# EAGLE schematic FULLMONI-WIDE_MAIN-Board_SCH (EAGLE 9.7.0)

## Sheet 1 of 4
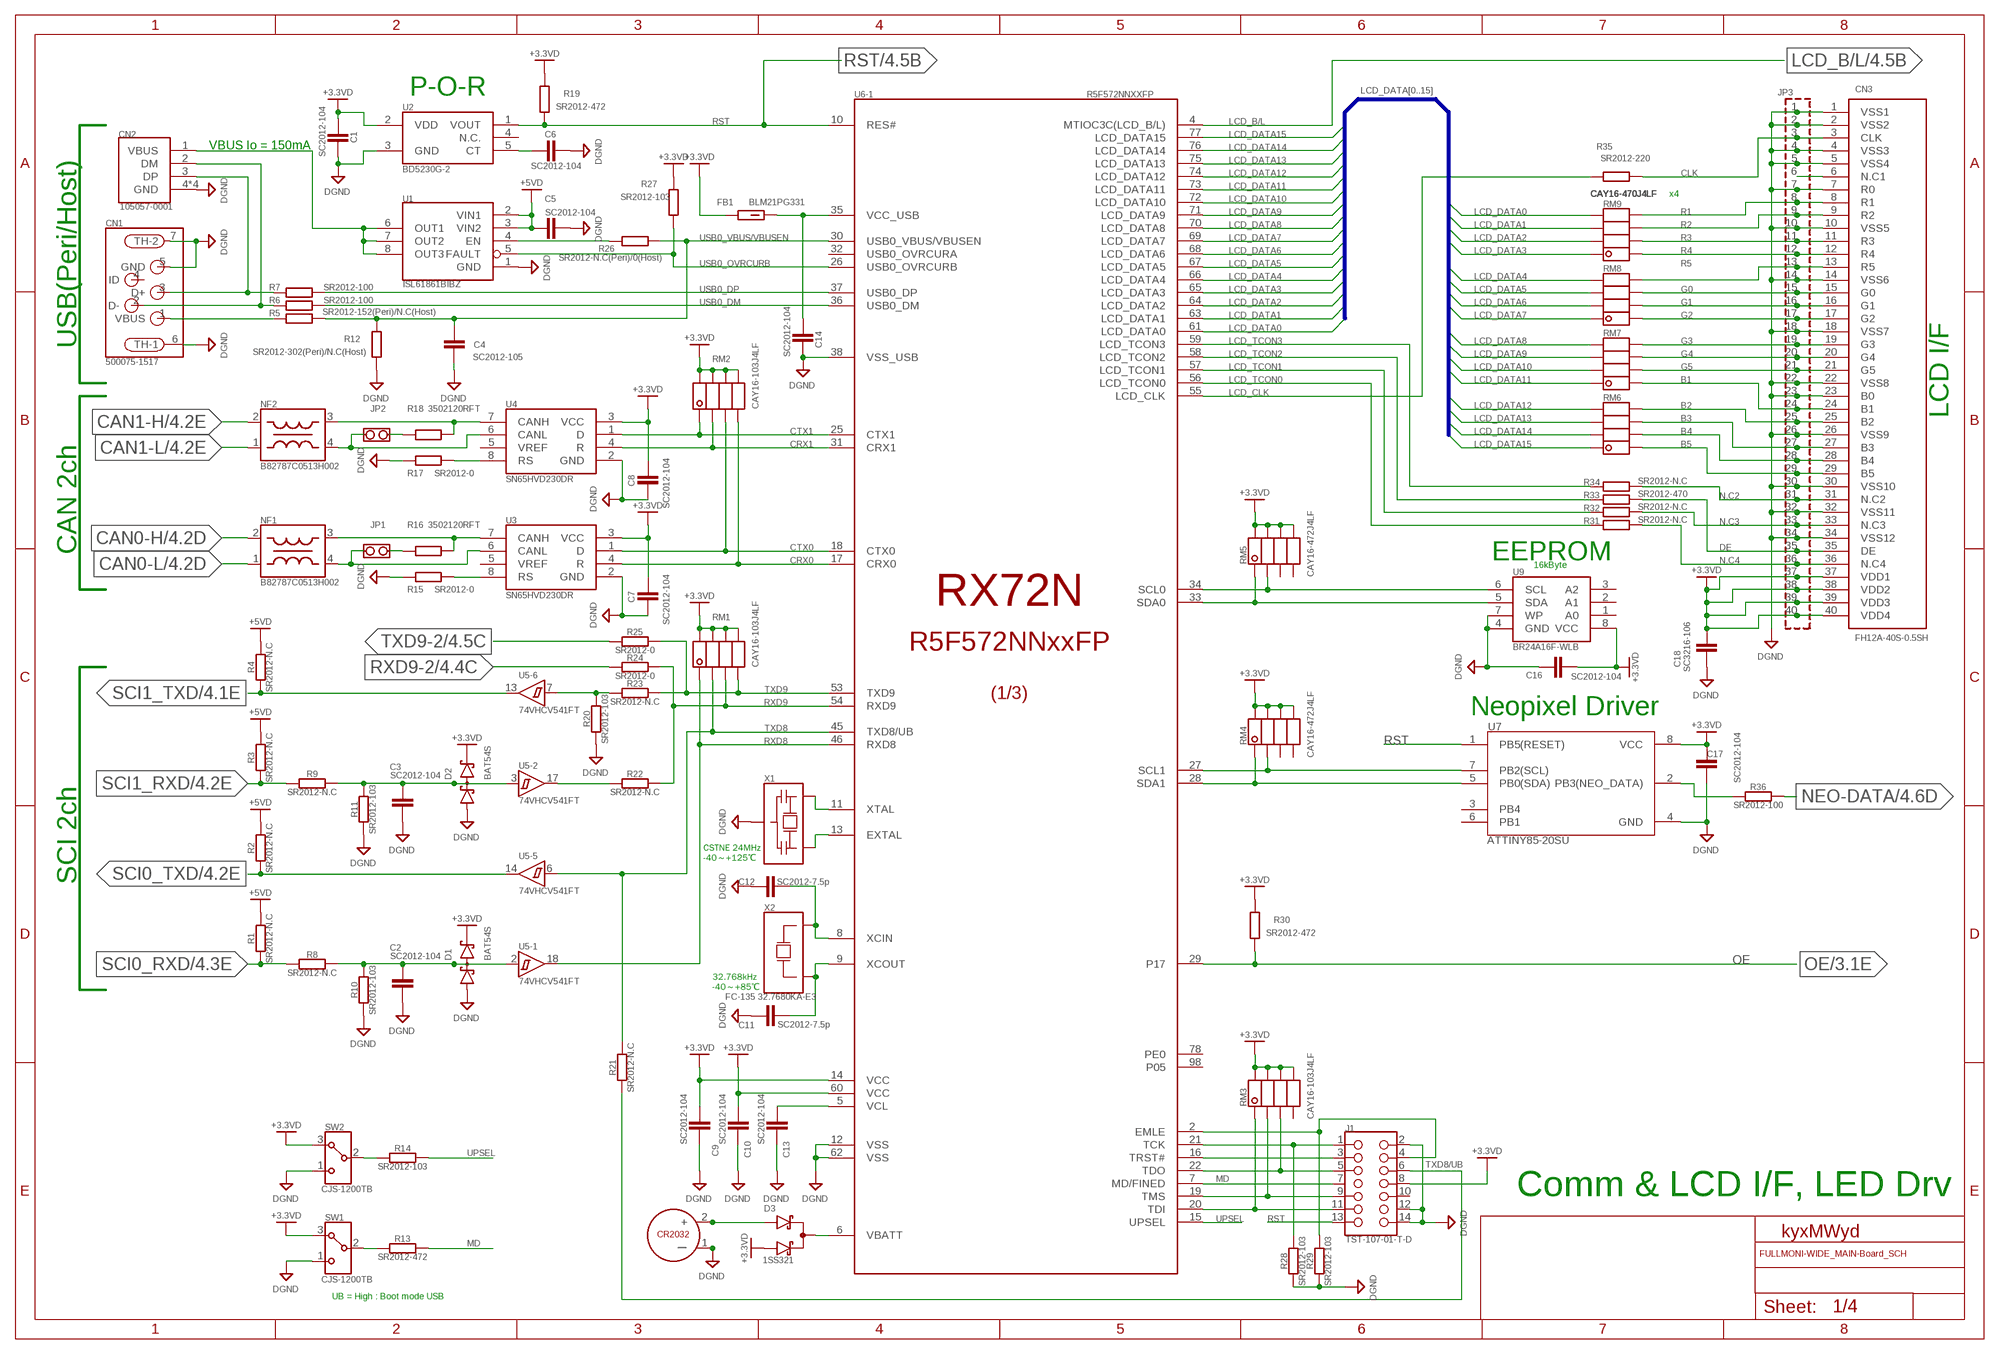
[diagram p0: schematic, sheet 1]

### Parts
BT1  120591-1  [120591-1]
C1  SC2012-104  C_CHIP-0805(2012-METRIC)  [CAPC2012X110]
C2  SC2012-104  C_CHIP-0805(2012-METRIC)  [CAPC2012X110]
C3  SC2012-104  C_CHIP-0805(2012-METRIC)  [CAPC2012X110]
C4  SC2012-105  C_CHIP-0805(2012-METRIC)  [CAPC2012X110]
C5  SC2012-104  C_CHIP-0805(2012-METRIC)  [CAPC2012X110]
C6  SC2012-104  C_CHIP-0805(2012-METRIC)  [CAPC2012X110]
C7  SC2012-104  C_CHIP-0805(2012-METRIC)  [CAPC2012X110]
C8  SC2012-104  C_CHIP-0805(2012-METRIC)  [CAPC2012X110]
C9  SC2012-104  C_CHIP-0805(2012-METRIC)  [CAPC2012X110]
C10  SC2012-104  C_CHIP-0805(2012-METRIC)  [CAPC2012X110]
C11  SC2012-7.5p  C_CHIP-0805(2012-METRIC)  [CAPC2012X110]
C12  SC2012-7.5p  C_CHIP-0805(2012-METRIC)  [CAPC2012X110]
C13  SC2012-104  C_CHIP-0805(2012-METRIC)  [CAPC2012X110]
C14  SC2012-104  C_CHIP-0805(2012-METRIC)  [CAPC2012X110]
C16  SC2012-104  C_CHIP-0805(2012-METRIC)  [CAPC2012X110]
C17  SC2012-104  C_CHIP-0805(2012-METRIC)  [CAPC2012X110]
C18  SC3216-106  C_CHIP-1206(3216-METRIC)  [CAPC3216X135]
CN1  500075-1517  [500075-1517]
CN2  105057-0001  [105057-0001]
CN3  FH12A-40S-0.5SH  [FH12A-40S-0.5SH]
D1  BAT54S  [SOT23]
D2  BAT54S  [SOT23]
D3  1SS321  [1SS321]
FB1  BLM21PG331  FB_BLM21PG331SN1D_0805(2012)  [BEADC2012X105N]
J1  TST-107-01-T-D  SAMTEC-TST-107-01-X-DJ  [SAMTEC-TST-107-01-X-D]
JP1  PINHD-1X2/90  [1X02/90]
JP2  PINHD-1X2/90  [1X02/90]
JP3  PINHD-2X20  [2X20]
NF1  B82787C0513H002  ACT45B-510-2P  [ACT45B-510-2P]
NF2  B82787C0513H002  ACT45B-510-2P  [ACT45B-510-2P]
R1  SR2012-N.C  R_CHIP-0805(2012-METRIC)  [RESC2012X65]
R2  SR2012-N.C  R_CHIP-0805(2012-METRIC)  [RESC2012X65]
R3  SR2012-N.C  R_CHIP-0805(2012-METRIC)  [RESC2012X65]
R4  SR2012-N.C  R_CHIP-0805(2012-METRIC)  [RESC2012X65]
R5  SR2012-152(Peri)/N.C(Host)  R_CHIP-0805(2012-METRIC)  [RESC2012X65]
R6  SR2012-100  R_CHIP-0805(2012-METRIC)  [RESC2012X65]
R7  SR2012-100  R_CHIP-0805(2012-METRIC)  [RESC2012X65]
R8  SR2012-N.C  R_CHIP-0805(2012-METRIC)  [RESC2012X65]
R9  SR2012-N.C  R_CHIP-0805(2012-METRIC)  [RESC2012X65]
R10  SR2012-103  R_CHIP-0805(2012-METRIC)  [RESC2012X65]
R11  SR2012-103  R_CHIP-0805(2012-METRIC)  [RESC2012X65]
R12  SR2012-302(Peri)/N.C(Host)  R_CHIP-0805(2012-METRIC)  [RESC2012X65]
R13  SR2012-472  R_CHIP-0805(2012-METRIC)  [RESC2012X65]
R14  SR2012-103  R_CHIP-0805(2012-METRIC)  [RESC2012X65]
R15  SR2012-0  R_CHIP-0805(2012-METRIC)  [RESC2012X65]
R16  3502120RFT  R_CHIP-2010(5025-METRIC)  [RESC5025X71]
R17  SR2012-0  R_CHIP-0805(2012-METRIC)  [RESC2012X65]
R18  3502120RFT  R_CHIP-2010(5025-METRIC)  [RESC5025X71]
R19  SR2012-472  R_CHIP-0805(2012-METRIC)  [RESC2012X65]
R20  SR2012-103  R_CHIP-0805(2012-METRIC)  [RESC2012X65]
R21  SR2012-N.C  R_CHIP-0805(2012-METRIC)  [RESC2012X65]
R22  SR2012-N.C  R_CHIP-0805(2012-METRIC)  [RESC2012X65]
R23  SR2012-N.C  R_CHIP-0805(2012-METRIC)  [RESC2012X65]
R24  SR2012-0  R_CHIP-0805(2012-METRIC)  [RESC2012X65]
R25  SR2012-0  R_CHIP-0805(2012-METRIC)  [RESC2012X65]
R26  SR2012-N.C(Peri)/0(Host)  R_CHIP-0805(2012-METRIC)  [RESC2012X65]
R27  SR2012-103  R_CHIP-0805(2012-METRIC)  [RESC2012X65]
R28  SR2012-103  R_CHIP-0805(2012-METRIC)  [RESC2012X65]
R29  SR2012-103  R_CHIP-0805(2012-METRIC)  [RESC2012X65]
R30  SR2012-472  R_CHIP-0805(2012-METRIC)  [RESC2012X65]
R31  SR2012-N.C  R_CHIP-0805(2012-METRIC)  [RESC2012X65]
R32  SR2012-N.C  R_CHIP-0805(2012-METRIC)  [RESC2012X65]
R33  SR2012-470  R_CHIP-0805(2012-METRIC)  [RESC2012X65]
R34  SR2012-N.C  R_CHIP-0805(2012-METRIC)  [RESC2012X65]
R35  SR2012-220  R_CHIP-0805(2012-METRIC)  [RESC2012X65]
R36  SR2012-100  R_CHIP-0805(2012-METRIC)  [RESC2012X65]
RM1  CAY16-103J4LF  CN1J4TTD000J  [CN1J4TTD000J]
RM2  CAY16-103J4LF  CN1J4TTD000J  [CN1J4TTD000J]
RM3  CAY16-103J4LF  CN1J4TTD000J  [CN1J4TTD000J]
RM4  CAY16-472J4LF  CN1J4TTD000J  [CN1J4TTD000J]
RM5  CAY16-472J4LF  CN1J4TTD000J  [CN1J4TTD000J]
RM6  CAY16-470J4LF  CN1J4TTD000J  [CN1J4TTD000J]
RM7  CAY16-470J4LF  CN1J4TTD000J  [CN1J4TTD000J]
RM8  CAY16-470J4LF  CN1J4TTD000J  [CN1J4TTD000J]
RM9  CAY16-470J4LF  CN1J4TTD000J  [CN1J4TTD000J]
SW1  CJS-1200TB  CJS-1200B  [CJS-1200B]
SW2  CJS-1200TB  CJS-1200B  [CJS-1200B]
U1  ISL61861BIBZ  [ISL61861BIBZ]
U2  BD5230G-2  BD5230G-1  [BD5230G-1]
U3  SN65HVD230DR  SN65HVD230D  [SO-8]
U4  SN65HVD230DR  SN65HVD230D  [SO-8]
U5  74VHCV541FT  [74VHCV54XFT]
U6  R5F572NNXXFP  [R5F572NNXXFP]
U7  ATTINY85-20SU  ATTINY85-20SUR8S2_ATM-M  [8S2_ATM-M]
U9  BR24A16F-WLB  [BR24A16F-WLB]
X1  CSTNE24M0VH3C000  [CSTNE24M0VH3C000]
X2  FC-135 32.7680KA-E3  FC-135  [FC-135]

### Nets
+3.3VD: C1.1 C7.1 C8.1 C9.1 C10.1 C16.1 C17.1 C18.1 CN3.37(VDD1) CN3.38(VDD2) CN3.39(VDD3) CN3.40(VDD4) D1.2(C2) D2.2(C2) D3.2(A2) FB1.1 J1.8 JP3.37 JP3.38 JP3.39 JP3.40 R19.2 R27.2 R30.2 RM1.P$5 RM1.P$6 RM1.P$7 RM1.P$8 RM2.P$5 RM2.P$6 RM2.P$7 RM2.P$8 RM3.P$5 RM3.P$6 RM3.P$7 RM3.P$8 RM4.P$5 RM4.P$6 RM4.P$7 RM4.P$8 RM5.P$5 RM5.P$6 RM5.P$7 RM5.P$8 SW1.3 SW2.3 U2.2(VDD) U3.3(VCC) U4.3(VCC) U6.14(-1:VCC) U6.60(-1:VCC) U7.8(VCC) U9.8(VCC) ; supply symbol labelled +V ; also sheet 2,3,4
+5VD: C5.1 R1.2 R2.2 R3.2 R4.2 U1.2(VIN1) U1.3(VIN2) ; supply symbol labelled +V ; also sheet 2,3,4
B1: CN3.24(B1) JP3.24 RM7.P$8
B2: CN3.25(B2) JP3.25 RM6.P$5
B3: CN3.27(B3) JP3.27 RM6.P$6
B4: CN3.28(B4) JP3.28 RM6.P$7
B5: CN3.29(B5) JP3.29 RM6.P$8
CAN0-H: NF1.2 ; also sheet 4
CAN0-L: NF1.1 ; also sheet 4
CAN1-H: NF2.2 ; also sheet 4
CAN1-L: NF2.1 ; also sheet 4
CLK: CN3.3(CLK) JP3.3 R35.2
CR2032: BT1.2(+) BT1.3(+1) D3.1(A1)
CRX0: RM2.P$4 U3.4(R) U6.17(-1:CRX0)
CRX1: RM2.P$2 U4.4(R) U6.31(-1:CRX1)
CTX0: RM2.P$3 U3.1(D) U6.18(-1:CTX0)
CTX1: RM2.P$1 U4.1(D) U6.25(-1:CTX1)
DE: CN3.35(DE) JP3.35 R33.2
DGND: BT1.1(ー) C1.2 C2.2 C3.2 C4.2 C5.2 C6.2 C7.2 C8.2 C9.2 C10.2 C11.1 C12.1 C13.1 C14.2 C16.2 C17.2 C18.2 CN1.5(GND) CN1.6(TH-1) CN1.7(TH-2) CN2.4(GND) CN2.F1(GND) CN2.F2(GND) CN2.F3(GND) CN3.1(VSS1) CN3.2(VSS2) CN3.4(VSS3) CN3.5(VSS4) CN3.7(R0) CN3.10(VSS5) CN3.14(VSS6) CN3.18(VSS7) CN3.22(VSS8) CN3.23(B0) CN3.26(VSS9) CN3.30(VSS10) CN3.32(VSS11) CN3.34(VSS12) D1.1(A1) D2.1(A1) J1.2 J1.12 J1.14 JP3.1 JP3.2 JP3.4 JP3.5 JP3.7 JP3.10 JP3.14 JP3.18 JP3.22 JP3.23 JP3.26 JP3.30 JP3.32 JP3.34 R10.1 R11.1 R12.1 R15.1 R17.1 R20.1 R28.1 R29.1 SW1.1 SW2.1 U1.1(GND) U2.3(GND) U3.2(GND) U4.2(GND) U6.12(-1:VSS) U6.38(-1:VSS_USB) U6.62(-1:VSS) U7.4(GND) U9.4(GND) U9.7(WP) X1.2 ; also sheet 3,4
EMLE: J1.4 R29.2 U6.2(-1:EMLE)
EXTAL: U6.13(-1:EXTAL) X1.3
G0: CN3.15(G0) JP3.15 RM8.P$6
G1: CN3.16(G1) JP3.16 RM8.P$7
G2: CN3.17(G2) JP3.17 RM8.P$8
G3: CN3.19(G3) JP3.19 RM7.P$5
G4: CN3.20(G4) JP3.20 RM7.P$6
G5: CN3.21(G5) JP3.21 RM7.P$7
LCD_B/L: U6.4(-1:MTIOC3C(LCD_B/L)) ; also sheet 4
LCD_CLK: R35.1 U6.55(-1:LCD_CLK)
LCD_DATA0: RM9.P$4 U6.61(-1:LCD_DATA0)
LCD_DATA1: RM9.P$3 U6.63(-1:LCD_DATA1)
LCD_DATA2: RM9.P$2 U6.64(-1:LCD_DATA2)
LCD_DATA3: RM9.P$1 U6.65(-1:LCD_DATA3)
LCD_DATA4: RM8.P$4 U6.66(-1:LCD_DATA4)
LCD_DATA5: RM8.P$3 U6.67(-1:LCD_DATA5)
LCD_DATA6: RM8.P$2 U6.68(-1:LCD_DATA6)
LCD_DATA7: RM8.P$1 U6.69(-1:LCD_DATA7)
LCD_DATA8: RM7.P$4 U6.70(-1:LCD_DATA8)
LCD_DATA9: RM7.P$3 U6.71(-1:LCD_DATA9)
LCD_DATA10: RM7.P$2 U6.72(-1:LCD_DATA10)
LCD_DATA11: RM7.P$1 U6.73(-1:LCD_DATA11)
LCD_DATA12: RM6.P$4 U6.74(-1:LCD_DATA12)
LCD_DATA13: RM6.P$3 U6.75(-1:LCD_DATA13)
LCD_DATA14: RM6.P$2 U6.76(-1:LCD_DATA14)
LCD_DATA15: RM6.P$1 U6.77(-1:LCD_DATA15)
LCD_TCON0: R31.1 U6.56(-1:LCD_TCON0)
LCD_TCON1: R32.1 U6.57(-1:LCD_TCON1)
LCD_TCON2: R33.1 U6.58(-1:LCD_TCON2)
LCD_TCON3: R34.1 U6.59(-1:LCD_TCON3)
MD: J1.7 R13.2 U6.7(-1:MD/FINED)
N$1: CN3.6(N.C1) JP3.6
N$2: NF1.3 R16.2 U3.7(CANH)
N$3: NF2.3 R18.2 U4.7(CANH)
N$8: R15.2 U3.8(RS)
N$9: JP1.1 NF1.4 U3.6(CANL)
N$10: JP1.2 R16.1
N$11: JP2.2 R18.1
N$13: JP2.1 NF2.4 U4.6(CANL)
N$14: R17.2 U4.8(RS)
N$15: R26.1 U1.4(EN)
N$16: CN2.1(VBUS) U1.6(OUT1) U1.7(OUT2) U1.8(OUT3)
N$18: R20.2 R23.1 U5.7(-6:A)
N$25: R22.1 U5.17(-2:Y)
N$62: R14.1 SW2.2
N$73: R13.1 SW1.2
N$77: R36.1 U7.2(PB3(NEO_DATA))
N$95: CN1.3(D+) CN2.3(DP) R7.1
N$96: CN1.2(D-) CN2.2(DM) R6.1
N$97: CN1.1(VBUS) R5.1
N$98: C6.1 U2.5(CT)
N.C2: CN3.31(N.C2) JP3.31 R34.2
N.C3: CN3.33(N.C3) JP3.33 R32.2
N.C4: CN3.36(N.C4) JP3.36 R31.2
NEO-DATA: R36.2 ; also sheet 4
OE: R30.1 U6.29(-1:P17) ; also sheet 3
R1: CN3.8(R1) JP3.8 RM9.P$5
R2: CN3.9(R2) JP3.9 RM9.P$6
R3: CN3.11(R3) JP3.11 RM9.P$7
R4: CN3.12(R4) JP3.12 RM9.P$8
R5: CN3.13(R5) JP3.13 RM8.P$5
RST: J1.13 R19.1 U2.1(VOUT) U6.10(-1:RES#) U7.1(PB5(RESET)) ; also sheet 4
RXD8: RM1.P$1 U5.18(-1:Y) U6.46(-1:RXD8)
RXD9: R22.2 R24.2 RM1.P$3 U6.54(-1:RXD9)
RXD9-2: R24.1 ; also sheet 4
SCI0_RXD: R1.1 R8.1 ; also sheet 4
SCI0_TXD: R2.1 U5.14(-5:Y) ; also sheet 4
SCI1_RXD: R3.1 R9.1 ; also sheet 4
SCI1_RXD1: C3.1 D2.3(C1A2) R9.2 R11.2 U5.3(-2:A)
SCI1_RXD2: C2.1 D1.3(C1A2) R8.2 R10.2 U5.2(-1:A)
SCI1_TXD: R4.1 U5.13(-6:Y) ; also sheet 4
SCL0: RM5.P$2 U6.34(-1:SCL0) U9.6(SCL)
SCL1: RM4.P$2 U6.27(-1:SCL1) U7.7(PB2(SCL))
SDA0: RM5.P$1 U6.33(-1:SDA0) U9.5(SDA)
SDA1: RM4.P$1 U6.28(-1:SDA1) U7.5(PB0(SDA))
TCK: J1.1 R28.2 U6.21(-1:TCK)
TDO: J1.5 RM3.P$3 U6.22(-1:TDO)
TMS: J1.9 RM3.P$2 U6.19(-1:TMS)
TRST: J1.3 U6.16(-1:TRST#)
TSI: J1.11 RM3.P$1 U6.20(-1:TDI)
TXD8: R21.2 RM1.P$2 U5.6(-5:A) U6.45(-1:TXD8/UB)
TXD8/UB: J1.6 R21.1
TXD9: R23.2 R25.2 RM1.P$4 U6.53(-1:TXD9)
TXD9-2: R25.1 ; also sheet 4
UPSEL: R14.2 U6.15(-1:UPSEL)
USB0_DM: R6.2 U6.36(-1:USB0_DM)
USB0_DP: R7.2 U6.37(-1:USB0_DP)
USB0_OVRCURB: R27.1 U1.5(FAULT) U6.26(-1:USB0_OVRCURB)
USB0_VBUS/VBUSEN: C4.1 R5.2 R12.2 R26.2 U6.30(-1:USB0_VBUS/VBUSEN)
VBATT: D3.3(C) U6.6(-1:VBATT)
VCC_USB: C14.1 FB1.2 U6.35(-1:VCC_USB)
VCL: C13.2 U6.5(-1:VCL)
XCIN: C12.2 U6.8(-1:XCIN) X2.1
XCOUT: C11.2 U6.9(-1:XCOUT) X2.2
XTAL: U6.11(-1:XTAL) X1.1
Unconnected: CN1.4(ID) J1.10 RM3.P$4 RM4.P$3 RM4.P$4 RM5.P$3 RM5.P$4 U2.4(N.C.) U3.5(VREF) U4.5(VREF) U6.32(-1:USB0_OVRCURA) U6.78(-1:PE0) U6.98(-1:P05) U7.3(PB4) U7.6(PB1) U9.1(A0) U9.2(A1) U9.3(A2)

### Buses
LCD_DATA[0..15]

### Notes on the sheet
- P-O-R
- VBUS Io = 150mA
- x4
- USB(Peri/Host)
- LCD I/F
- CAN 2ch
- EEPROM
- 16kByte
- Neopixel Driver
- SCI 2ch
- CSTNE 24MHz
  -40～+125℃
- 32.768kHz
  -40～+85℃
- Comm & LCD I/F, LED Drv
- ※UB = High : Boot mode USB

## Sheet 2 of 4
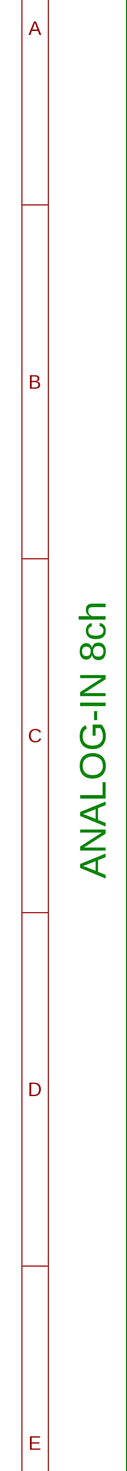
[diagram p1: schematic, sheet 2, part 1 of 2]
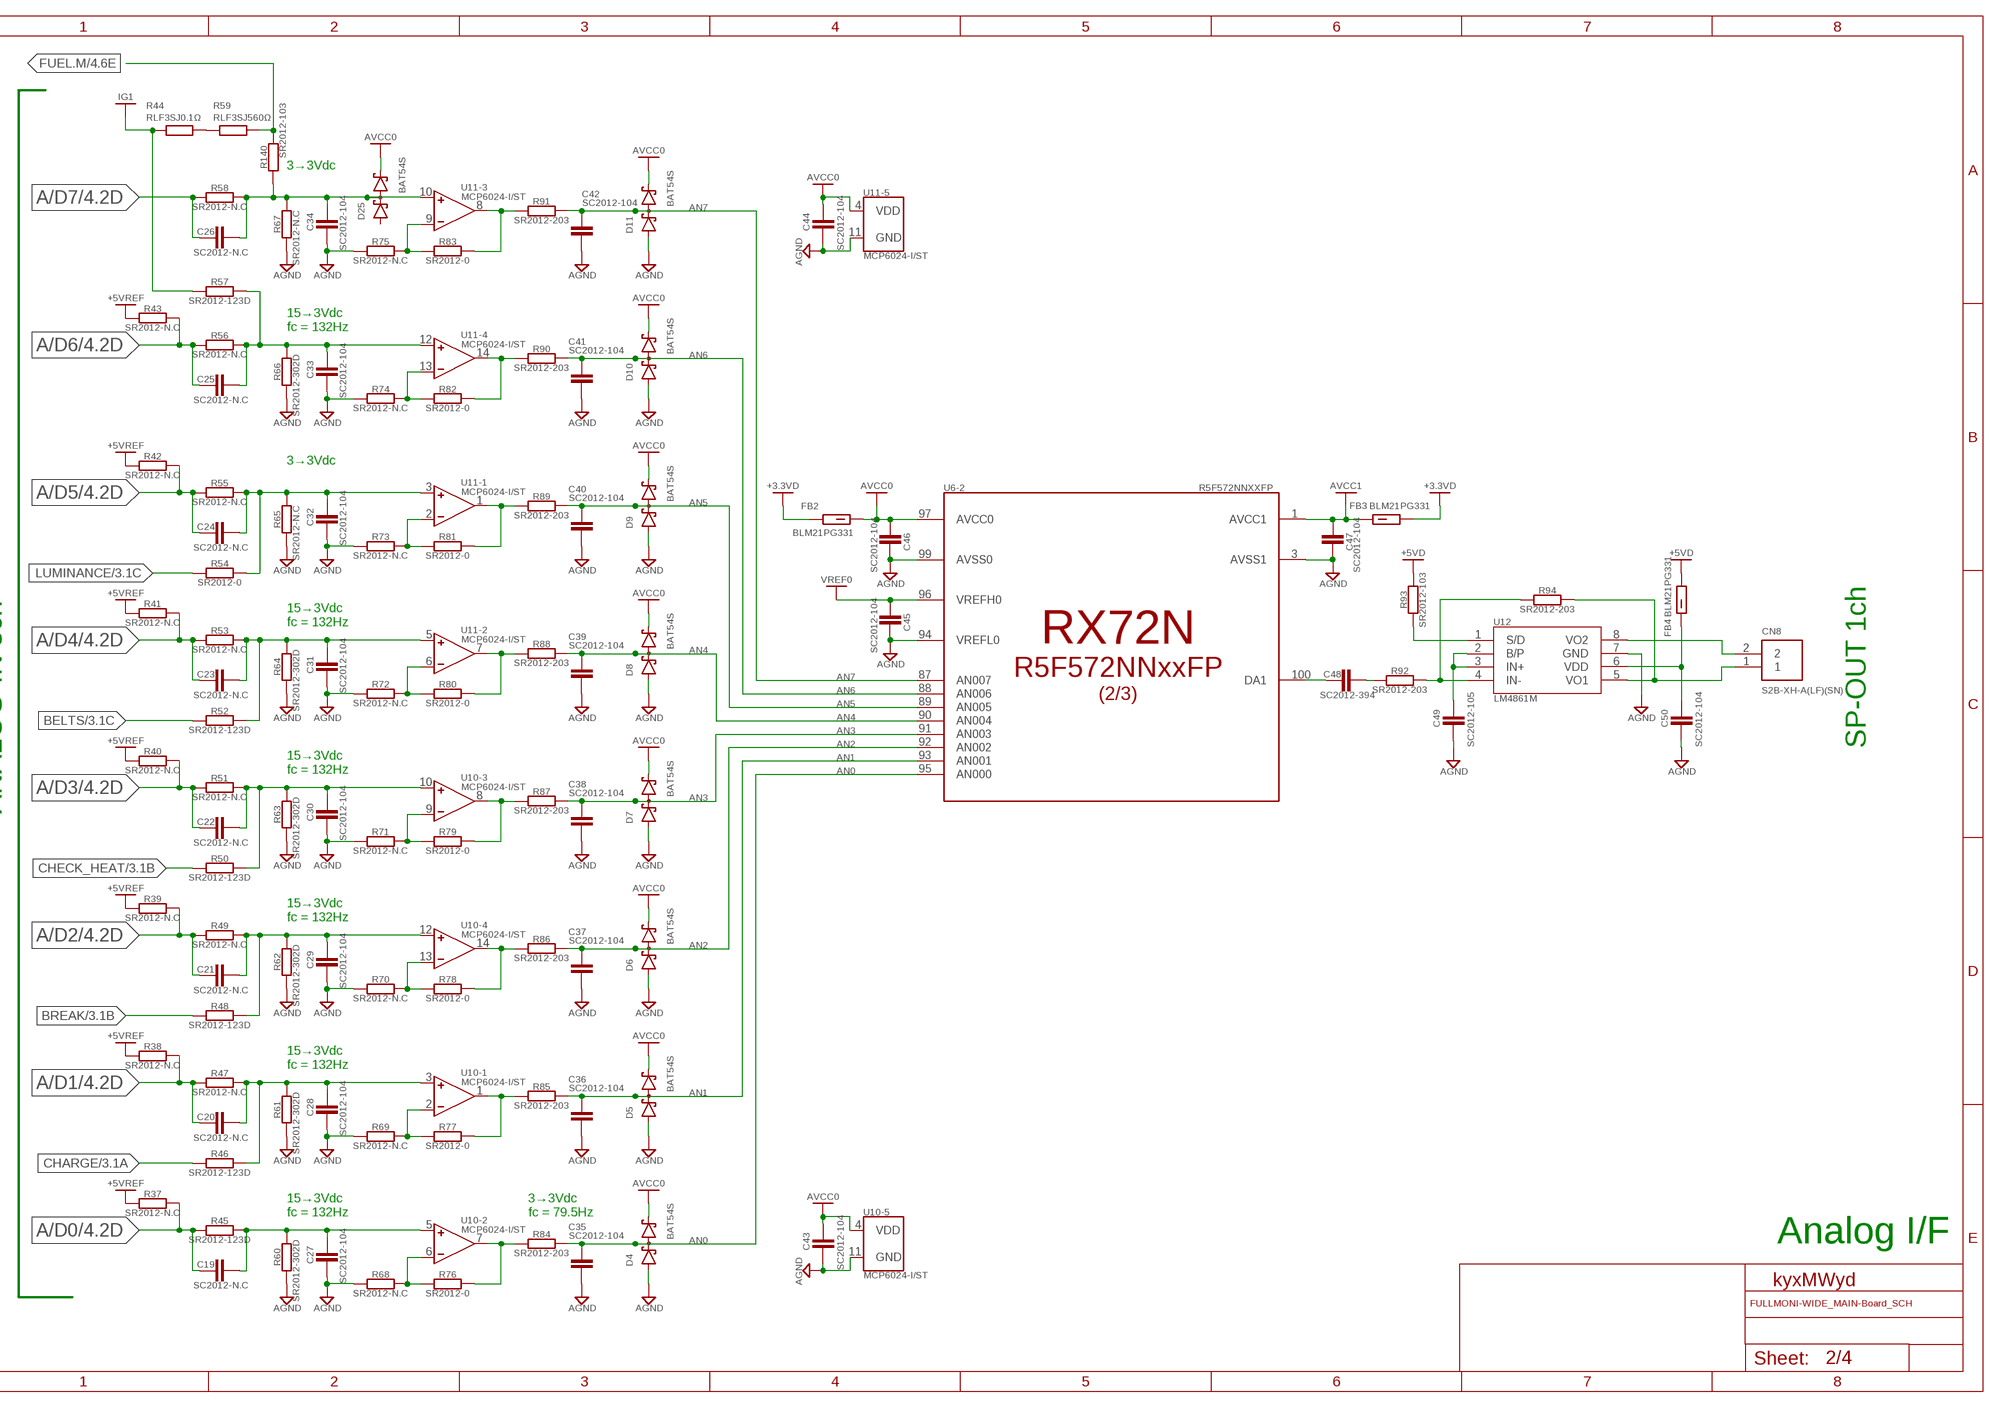
[diagram p2: schematic, sheet 2, part 2 of 2]

### Parts
C19  SC2012-N.C  C_CHIP-0805(2012-METRIC)  [CAPC2012X110]
C20  SC2012-N.C  C_CHIP-0805(2012-METRIC)  [CAPC2012X110]
C21  SC2012-N.C  C_CHIP-0805(2012-METRIC)  [CAPC2012X110]
C22  SC2012-N.C  C_CHIP-0805(2012-METRIC)  [CAPC2012X110]
C23  SC2012-N.C  C_CHIP-0805(2012-METRIC)  [CAPC2012X110]
C24  SC2012-N.C  C_CHIP-0805(2012-METRIC)  [CAPC2012X110]
C25  SC2012-N.C  C_CHIP-0805(2012-METRIC)  [CAPC2012X110]
C26  SC2012-N.C  C_CHIP-0805(2012-METRIC)  [CAPC2012X110]
C27  SC2012-104  C_CHIP-0805(2012-METRIC)  [CAPC2012X110]
C28  SC2012-104  C_CHIP-0805(2012-METRIC)  [CAPC2012X110]
C29  SC2012-104  C_CHIP-0805(2012-METRIC)  [CAPC2012X110]
C30  SC2012-104  C_CHIP-0805(2012-METRIC)  [CAPC2012X110]
C31  SC2012-104  C_CHIP-0805(2012-METRIC)  [CAPC2012X110]
C32  SC2012-104  C_CHIP-0805(2012-METRIC)  [CAPC2012X110]
C33  SC2012-104  C_CHIP-0805(2012-METRIC)  [CAPC2012X110]
C34  SC2012-104  C_CHIP-0805(2012-METRIC)  [CAPC2012X110]
C35  SC2012-104  C_CHIP-0805(2012-METRIC)  [CAPC2012X110]
C36  SC2012-104  C_CHIP-0805(2012-METRIC)  [CAPC2012X110]
C37  SC2012-104  C_CHIP-0805(2012-METRIC)  [CAPC2012X110]
C38  SC2012-104  C_CHIP-0805(2012-METRIC)  [CAPC2012X110]
C39  SC2012-104  C_CHIP-0805(2012-METRIC)  [CAPC2012X110]
C40  SC2012-104  C_CHIP-0805(2012-METRIC)  [CAPC2012X110]
C41  SC2012-104  C_CHIP-0805(2012-METRIC)  [CAPC2012X110]
C42  SC2012-104  C_CHIP-0805(2012-METRIC)  [CAPC2012X110]
C43  SC2012-104  C_CHIP-0805(2012-METRIC)  [CAPC2012X110]
C44  SC2012-104  C_CHIP-0805(2012-METRIC)  [CAPC2012X110]
C45  SC2012-104  C_CHIP-0805(2012-METRIC)  [CAPC2012X110]
C46  SC2012-104  C_CHIP-0805(2012-METRIC)  [CAPC2012X110]
C47  SC2012-104  C_CHIP-0805(2012-METRIC)  [CAPC2012X110]
C48  SC2012-394  C_CHIP-0805(2012-METRIC)  [CAPC2012X110]
C49  SC2012-105  C_CHIP-0805(2012-METRIC)  [CAPC2012X110]
C50  SC2012-104  C_CHIP-0805(2012-METRIC)  [CAPC2012X110]
CN8  S2B-XH-A(LF)(SN)  [HDR-02/RA]
D4  BAT54S  [SOT23]
D5  BAT54S  [SOT23]
D6  BAT54S  [SOT23]
D7  BAT54S  [SOT23]
D8  BAT54S  [SOT23]
D9  BAT54S  [SOT23]
D10  BAT54S  [SOT23]
D11  BAT54S  [SOT23]
D25  BAT54S  [SOT23]
FB2  BLM21PG331  FB_BLM21PG331SN1D_0805(2012)  [BEADC2012X105N]
FB3  BLM21PG331  FB_BLM21PG331SN1D_0805(2012)  [BEADC2012X105N]
FB4  BLM21PG331  FB_BLM21PG331SN1D_0805(2012)  [BEADC2012X105N]
R37  SR2012-N.C  R_CHIP-0805(2012-METRIC)  [RESC2012X65]
R38  SR2012-N.C  R_CHIP-0805(2012-METRIC)  [RESC2012X65]
R39  SR2012-N.C  R_CHIP-0805(2012-METRIC)  [RESC2012X65]
R40  SR2012-N.C  R_CHIP-0805(2012-METRIC)  [RESC2012X65]
R41  SR2012-N.C  R_CHIP-0805(2012-METRIC)  [RESC2012X65]
R42  SR2012-N.C  R_CHIP-0805(2012-METRIC)  [RESC2012X65]
R43  SR2012-N.C  R_CHIP-0805(2012-METRIC)  [RESC2012X65]
R44  RLF3SJ0.1Ω  RLF3SJ  [RLF3SJ]
R45  SR2012-123D  R_CHIP-0805(2012-METRIC)  [RESC2012X65]
R46  SR2012-123D  R_CHIP-0805(2012-METRIC)  [RESC2012X65]
R47  SR2012-N.C  R_CHIP-0805(2012-METRIC)  [RESC2012X65]
R48  SR2012-123D  R_CHIP-0805(2012-METRIC)  [RESC2012X65]
R49  SR2012-N.C  R_CHIP-0805(2012-METRIC)  [RESC2012X65]
R50  SR2012-123D  R_CHIP-0805(2012-METRIC)  [RESC2012X65]
R51  SR2012-N.C  R_CHIP-0805(2012-METRIC)  [RESC2012X65]
R52  SR2012-123D  R_CHIP-0805(2012-METRIC)  [RESC2012X65]
R53  SR2012-N.C  R_CHIP-0805(2012-METRIC)  [RESC2012X65]
R54  SR2012-0  R_CHIP-0805(2012-METRIC)  [RESC2012X65]
R55  SR2012-N.C  R_CHIP-0805(2012-METRIC)  [RESC2012X65]
R56  SR2012-N.C  R_CHIP-0805(2012-METRIC)  [RESC2012X65]
R57  SR2012-123D  R_CHIP-0805(2012-METRIC)  [RESC2012X65]
R58  SR2012-N.C  R_CHIP-0805(2012-METRIC)  [RESC2012X65]
R59  RLF3SJ560Ω  RLF3SJ  [RLF3SJ]
R60  SR2012-302D  R_CHIP-0805(2012-METRIC)  [RESC2012X65]
R61  SR2012-302D  R_CHIP-0805(2012-METRIC)  [RESC2012X65]
R62  SR2012-302D  R_CHIP-0805(2012-METRIC)  [RESC2012X65]
R63  SR2012-302D  R_CHIP-0805(2012-METRIC)  [RESC2012X65]
R64  SR2012-302D  R_CHIP-0805(2012-METRIC)  [RESC2012X65]
R65  SR2012-N.C  R_CHIP-0805(2012-METRIC)  [RESC2012X65]
R66  SR2012-302D  R_CHIP-0805(2012-METRIC)  [RESC2012X65]
R67  SR2012-N.C  R_CHIP-0805(2012-METRIC)  [RESC2012X65]
R68  SR2012-N.C  R_CHIP-0805(2012-METRIC)  [RESC2012X65]
R69  SR2012-N.C  R_CHIP-0805(2012-METRIC)  [RESC2012X65]
R70  SR2012-N.C  R_CHIP-0805(2012-METRIC)  [RESC2012X65]
R71  SR2012-N.C  R_CHIP-0805(2012-METRIC)  [RESC2012X65]
R72  SR2012-N.C  R_CHIP-0805(2012-METRIC)  [RESC2012X65]
R73  SR2012-N.C  R_CHIP-0805(2012-METRIC)  [RESC2012X65]
R74  SR2012-N.C  R_CHIP-0805(2012-METRIC)  [RESC2012X65]
R75  SR2012-N.C  R_CHIP-0805(2012-METRIC)  [RESC2012X65]
R76  SR2012-0  R_CHIP-0805(2012-METRIC)  [RESC2012X65]
R77  SR2012-0  R_CHIP-0805(2012-METRIC)  [RESC2012X65]
R78  SR2012-0  R_CHIP-0805(2012-METRIC)  [RESC2012X65]
R79  SR2012-0  R_CHIP-0805(2012-METRIC)  [RESC2012X65]
R80  SR2012-0  R_CHIP-0805(2012-METRIC)  [RESC2012X65]
R81  SR2012-0  R_CHIP-0805(2012-METRIC)  [RESC2012X65]
R82  SR2012-0  R_CHIP-0805(2012-METRIC)  [RESC2012X65]
R83  SR2012-0  R_CHIP-0805(2012-METRIC)  [RESC2012X65]
R84  SR2012-203  R_CHIP-0805(2012-METRIC)  [RESC2012X65]
R85  SR2012-203  R_CHIP-0805(2012-METRIC)  [RESC2012X65]
R86  SR2012-203  R_CHIP-0805(2012-METRIC)  [RESC2012X65]
R87  SR2012-203  R_CHIP-0805(2012-METRIC)  [RESC2012X65]
R88  SR2012-203  R_CHIP-0805(2012-METRIC)  [RESC2012X65]
R89  SR2012-203  R_CHIP-0805(2012-METRIC)  [RESC2012X65]
R90  SR2012-203  R_CHIP-0805(2012-METRIC)  [RESC2012X65]
R91  SR2012-203  R_CHIP-0805(2012-METRIC)  [RESC2012X65]
R92  SR2012-203  R_CHIP-0805(2012-METRIC)  [RESC2012X65]
R93  SR2012-103  R_CHIP-0805(2012-METRIC)  [RESC2012X65]
R94  SR2012-203  R_CHIP-0805(2012-METRIC)  [RESC2012X65]
R140  SR2012-103  R_CHIP-0805(2012-METRIC)  [RESC2012X65]
U10  MCP6024-I/ST  [MCP6024-I/ST]
U11  MCP6024-I/ST  [MCP6024-I/ST]
U12  LM4861M  [LM4818MX]

### Nets
+3.3VD: FB2.1 FB3.1 ; supply symbol labelled +V ; also sheet 1,3,4
+5VD: FB4.1 R93.2 ; supply symbol labelled +V ; also sheet 1,3,4
+5VREF: R37.1 R38.1 R39.1 R40.1 R41.1 R42.1 R43.1 ; supply symbol labelled +V ; also sheet 4
A/D0: C19.1 R37.2 R45.1 ; also sheet 4
A/D1: C20.1 R38.2 R47.1 ; also sheet 4
A/D2: C21.1 R39.2 R49.1 ; also sheet 4
A/D3: C22.1 R40.2 R51.1 ; also sheet 4
A/D4: C23.1 R41.2 R53.1 ; also sheet 4
A/D5: C24.1 R42.2 R55.1 ; also sheet 4
A/D6: C25.1 R43.2 R56.1 ; also sheet 4
A/D7: C26.1 R58.1 ; also sheet 4
AGND: C27.2 C28.2 C29.2 C30.2 C31.2 C32.2 C33.2 C34.2 C35.2 C36.2 C37.2 C38.2 C39.2 C40.2 C41.2 C42.2 C43.2 C44.2 C45.2 C46.2 C47.2 C49.2 C50.2 D4.1(A1) D5.1(A1) D6.1(A1) D7.1(A1) D8.1(A1) D9.1(A1) D10.1(A1) D11.1(A1) R60.1 R61.1 R62.1 R63.1 R64.1 R65.1 R66.1 R67.1 R68.1 R69.1 R70.1 R71.1 R72.1 R73.1 R74.1 R75.1 U6.3(-2:AVSS1) U6.94(-2:VREFL0) U6.99(-2:AVSS0) U10.11(-5:GND) U11.11(-5:GND) U12.7(GND) ; also sheet 4
AN0: C35.1 D4.3(C1A2) R84.2 U6.95(-2:AN000)
AN1: C36.1 D5.3(C1A2) R85.2 U6.93(-2:AN001)
AN2: C37.1 D6.3(C1A2) R86.2 U6.92(-2:AN002)
AN3: C38.1 D7.3(C1A2) R87.2 U6.91(-2:AN003)
AN4: C39.1 D8.3(C1A2) R88.2 U6.90(-2:AN004)
AN5: C40.1 D9.3(C1A2) R89.2 U6.89(-2:AN005)
AN6: C41.1 D10.3(C1A2) R90.2 U6.88(-2:AN006)
AN7: C42.1 D11.3(C1A2) R91.2 U6.87(-2:AN007)
AVCC0: C43.1 C44.1 C46.1 D4.2(C2) D5.2(C2) D6.2(C2) D7.2(C2) D8.2(C2) D9.2(C2) D10.2(C2) D11.2(C2) D25.2(C2) FB2.2 U6.97(-2:AVCC0) U10.4(-5:VDD) U11.4(-5:VDD) ; supply symbol labelled +V
AVCC1: C47.1 FB3.2 U6.1(-2:AVCC1) ; supply symbol labelled +V
BELTS: R52.1 ; also sheet 3,4
BREAK: R48.1 ; also sheet 3,4
CHARGE: R46.1 ; also sheet 3,4
CHECK_HEAT: R50.1 ; also sheet 3,4
DA1: C48.1 U6.100(-2:DA1)
FUEL.M: R59.2 R140.2 ; also sheet 4
IG1: R44.1 R57.1 ; supply symbol labelled +V ; also sheet 4
LUMINANCE: R54.1 ; also sheet 3,4
N$12: R68.2 R76.1 U10.6(-2:-)
N$17: R92.2 R94.1 U12.4(IN-)
N$22: R44.2 R59.1
N$24: C26.2 C34.1 D25.3(C1A2) R58.2 R67.2 R140.1 U11.10(-3:+)
N$29: C19.2 C27.1 R45.2 R60.2 U10.5(-2:+)
N$30: R69.2 R77.1 U10.2(-1:-)
N$32: C20.2 C28.1 R46.2 R47.2 R61.2 U10.3(-1:+)
N$33: R70.2 R78.1 U10.13(-4:-)
N$35: C21.2 C29.1 R48.2 R49.2 R62.2 U10.12(-4:+)
N$36: R71.2 R79.1 U10.9(-3:-)
N$38: C22.2 C30.1 R50.2 R51.2 R63.2 U10.10(-3:+)
N$39: R72.2 R80.1 U11.6(-2:-)
N$41: C23.2 C31.1 R52.2 R53.2 R64.2 U11.5(-2:+)
N$42: R73.2 R81.1 U11.2(-1:-)
N$44: C24.2 C32.1 R54.2 R55.2 R65.2 U11.3(-1:+)
N$45: R74.2 R82.1 U11.13(-4:-)
N$47: C25.2 C33.1 R56.2 R57.2 R66.2 U11.12(-4:+)
N$48: R75.2 R83.1 U11.9(-3:-)
N$52: R76.2 R84.1 U10.7(-2:OUT)
N$57: R77.2 R85.1 U10.1(-1:OUT)
N$59: R78.2 R86.1 U10.14(-4:OUT)
N$61: R79.2 R87.1 U10.8(-3:OUT)
N$63: R80.2 R88.1 U11.7(-2:OUT)
N$64: R81.2 R89.1 U11.1(-1:OUT)
N$65: R82.2 R90.1 U11.14(-4:OUT)
N$66: R83.2 R91.1 U11.8(-3:OUT)
N$89: CN8.1 R94.2 U12.5(VO1)
N$90: C50.1 FB4.2 U12.6(VDD)
N$91: C48.2 R92.1
N$116: C49.1 U12.2(B/P) U12.3(IN+)
N$118: CN8.2 U12.8(VO2)
N$119: R93.1 U12.1(S/D)
VREF0: C45.1 U6.96(-2:VREFH0) ; supply symbol labelled +V ; also sheet 4
Unconnected: D25.1(A1)

### Notes on the sheet
- 3→3Vdc
- 15→3Vdc
  fc = 132Hz
- 3→3Vdc
- 15→3Vdc
  fc = 132Hz
- SP-OUT 1ch
- ANALOG-IN 8ch
- 15→3Vdc
  fc = 132Hz
- 15→3Vdc
  fc = 132Hz
- 15→3Vdc
  fc = 132Hz
- 15→3Vdc
  fc = 132Hz
- 3→3Vdc
  fc = 79.5Hz
- Analog I/F

## Sheet 3 of 4
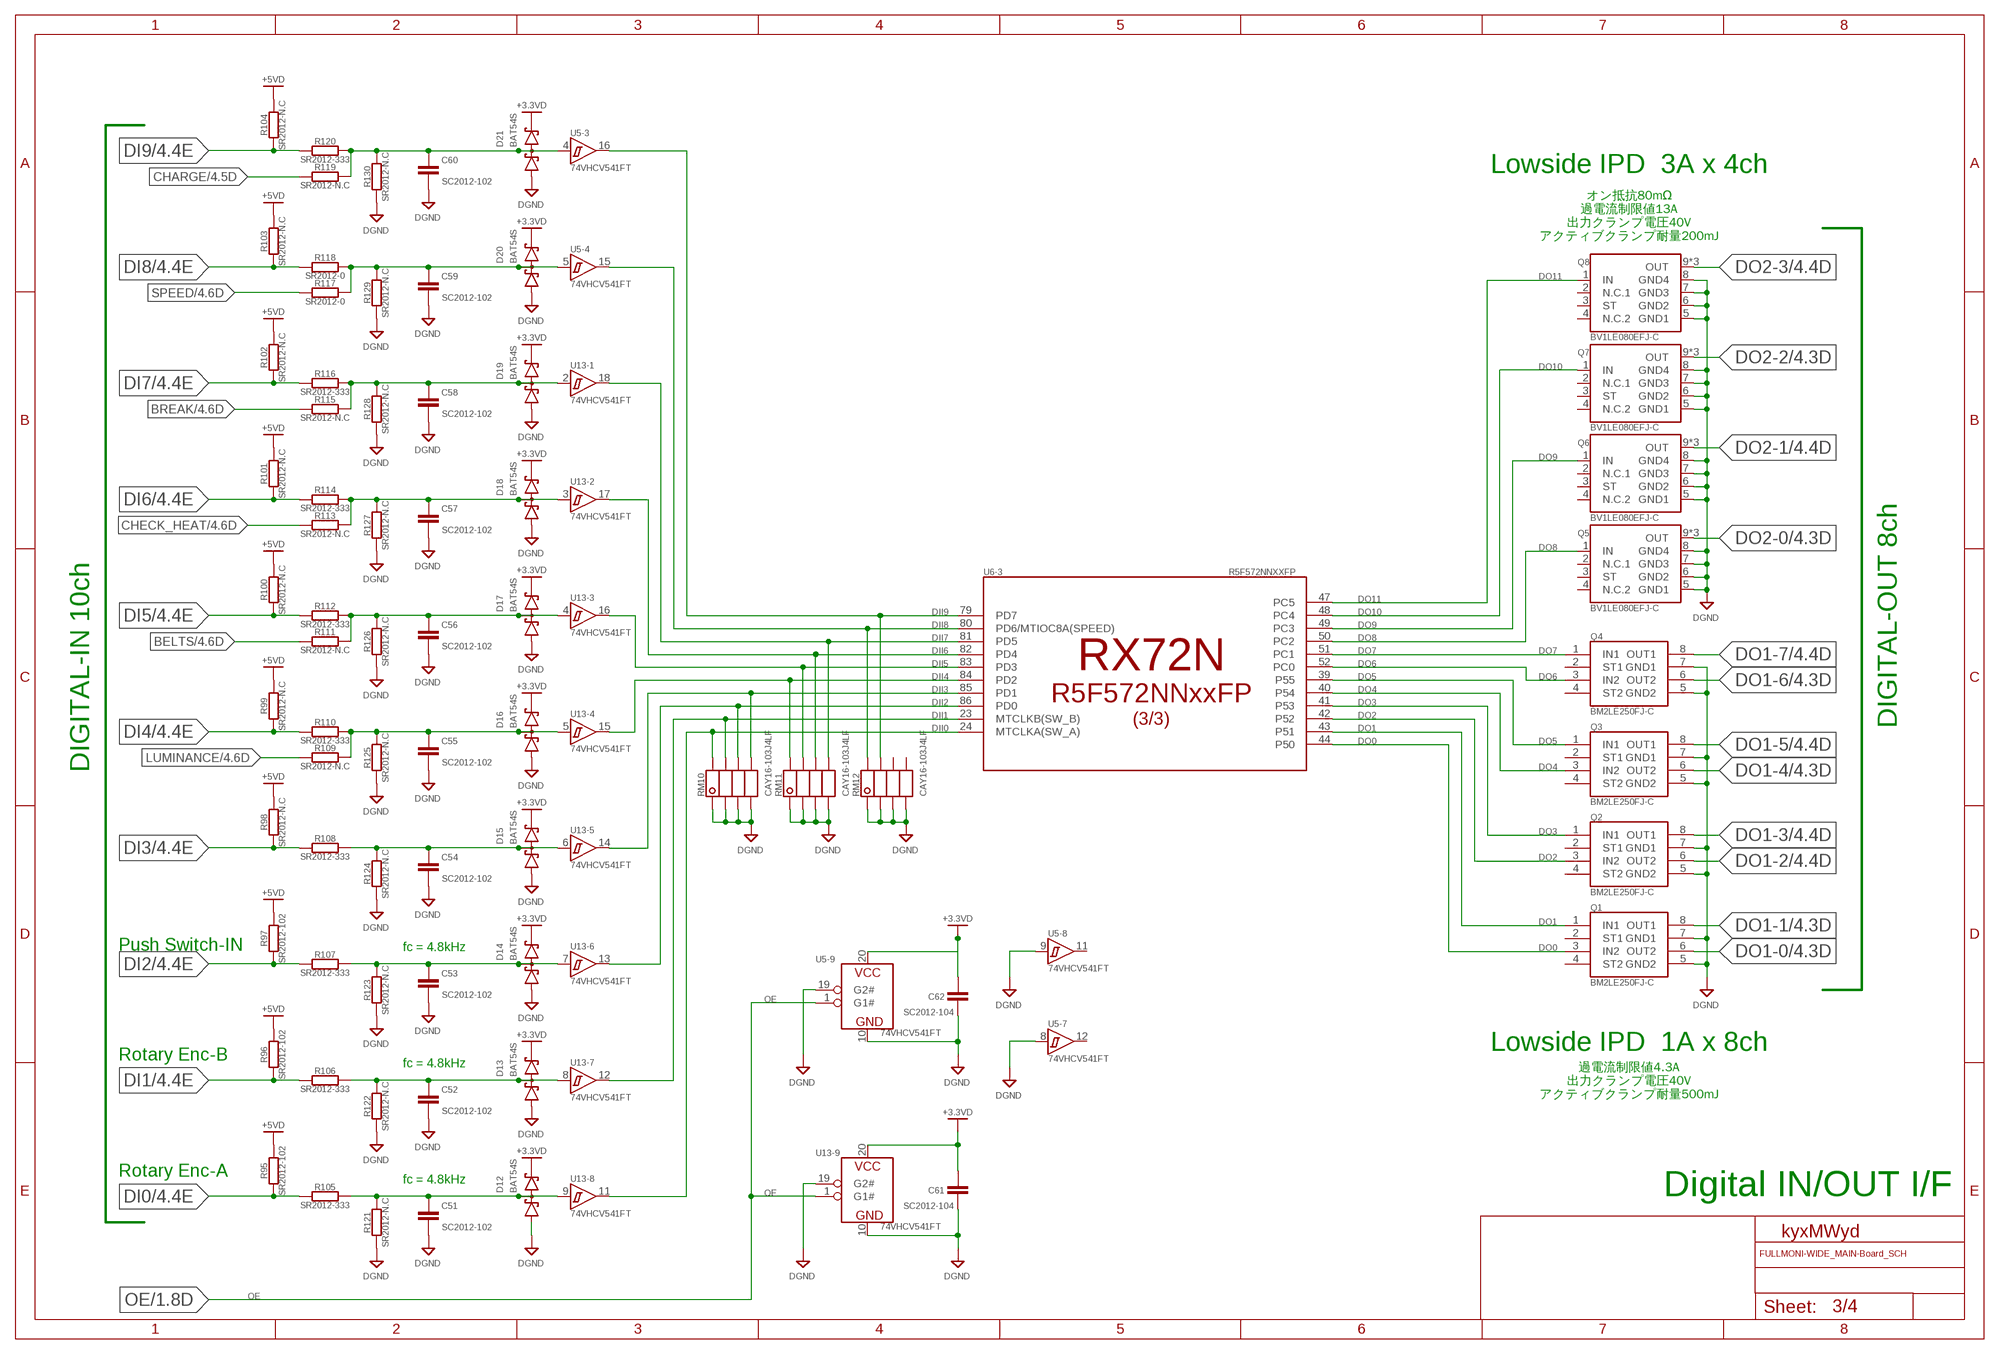
[diagram p3: schematic, sheet 3]

### Parts
C51  SC2012-102  C_CHIP-0805(2012-METRIC)  [CAPC2012X110]
C52  SC2012-102  C_CHIP-0805(2012-METRIC)  [CAPC2012X110]
C53  SC2012-102  C_CHIP-0805(2012-METRIC)  [CAPC2012X110]
C54  SC2012-102  C_CHIP-0805(2012-METRIC)  [CAPC2012X110]
C55  SC2012-102  C_CHIP-0805(2012-METRIC)  [CAPC2012X110]
C56  SC2012-102  C_CHIP-0805(2012-METRIC)  [CAPC2012X110]
C57  SC2012-102  C_CHIP-0805(2012-METRIC)  [CAPC2012X110]
C58  SC2012-102  C_CHIP-0805(2012-METRIC)  [CAPC2012X110]
C59  SC2012-102  C_CHIP-0805(2012-METRIC)  [CAPC2012X110]
C60  SC2012-102  C_CHIP-0805(2012-METRIC)  [CAPC2012X110]
C61  SC2012-104  C_CHIP-0805(2012-METRIC)  [CAPC2012X110]
C62  SC2012-104  C_CHIP-0805(2012-METRIC)  [CAPC2012X110]
D12  BAT54S  [SOT23]
D13  BAT54S  [SOT23]
D14  BAT54S  [SOT23]
D15  BAT54S  [SOT23]
D16  BAT54S  [SOT23]
D17  BAT54S  [SOT23]
D18  BAT54S  [SOT23]
D19  BAT54S  [SOT23]
D20  BAT54S  [SOT23]
D21  BAT54S  [SOT23]
Q1  BM2LE250FJ-C  [BM2LE250FJ-C]
Q2  BM2LE250FJ-C  [BM2LE250FJ-C]
Q3  BM2LE250FJ-C  [BM2LE250FJ-C]
Q4  BM2LE250FJ-C  [BM2LE250FJ-C]
Q5  BV1LE080EFJ-C  [BV1LE080EFJ-C]
Q6  BV1LE080EFJ-C  [BV1LE080EFJ-C]
Q7  BV1LE080EFJ-C  [BV1LE080EFJ-C]
Q8  BV1LE080EFJ-C  [BV1LE080EFJ-C]
R95  SR2012-102  R_CHIP-0805(2012-METRIC)  [RESC2012X65]
R96  SR2012-102  R_CHIP-0805(2012-METRIC)  [RESC2012X65]
R97  SR2012-102  R_CHIP-0805(2012-METRIC)  [RESC2012X65]
R98  SR2012-N.C  R_CHIP-0805(2012-METRIC)  [RESC2012X65]
R99  SR2012-N.C  R_CHIP-0805(2012-METRIC)  [RESC2012X65]
R100  SR2012-N.C  R_CHIP-0805(2012-METRIC)  [RESC2012X65]
R101  SR2012-N.C  R_CHIP-0805(2012-METRIC)  [RESC2012X65]
R102  SR2012-N.C  R_CHIP-0805(2012-METRIC)  [RESC2012X65]
R103  SR2012-N.C  R_CHIP-0805(2012-METRIC)  [RESC2012X65]
R104  SR2012-N.C  R_CHIP-0805(2012-METRIC)  [RESC2012X65]
R105  SR2012-333  R_CHIP-0805(2012-METRIC)  [RESC2012X65]
R106  SR2012-333  R_CHIP-0805(2012-METRIC)  [RESC2012X65]
R107  SR2012-333  R_CHIP-0805(2012-METRIC)  [RESC2012X65]
R108  SR2012-333  R_CHIP-0805(2012-METRIC)  [RESC2012X65]
R109  SR2012-N.C  R_CHIP-0805(2012-METRIC)  [RESC2012X65]
R110  SR2012-333  R_CHIP-0805(2012-METRIC)  [RESC2012X65]
R111  SR2012-N.C  R_CHIP-0805(2012-METRIC)  [RESC2012X65]
R112  SR2012-333  R_CHIP-0805(2012-METRIC)  [RESC2012X65]
R113  SR2012-N.C  R_CHIP-0805(2012-METRIC)  [RESC2012X65]
R114  SR2012-333  R_CHIP-0805(2012-METRIC)  [RESC2012X65]
R115  SR2012-N.C  R_CHIP-0805(2012-METRIC)  [RESC2012X65]
R116  SR2012-333  R_CHIP-0805(2012-METRIC)  [RESC2012X65]
R117  SR2012-0  R_CHIP-0805(2012-METRIC)  [RESC2012X65]
R118  SR2012-0  R_CHIP-0805(2012-METRIC)  [RESC2012X65]
R119  SR2012-N.C  R_CHIP-0805(2012-METRIC)  [RESC2012X65]
R120  SR2012-333  R_CHIP-0805(2012-METRIC)  [RESC2012X65]
R121  SR2012-N.C  R_CHIP-0805(2012-METRIC)  [RESC2012X65]
R122  SR2012-N.C  R_CHIP-0805(2012-METRIC)  [RESC2012X65]
R123  SR2012-N.C  R_CHIP-0805(2012-METRIC)  [RESC2012X65]
R124  SR2012-N.C  R_CHIP-0805(2012-METRIC)  [RESC2012X65]
R125  SR2012-N.C  R_CHIP-0805(2012-METRIC)  [RESC2012X65]
R126  SR2012-N.C  R_CHIP-0805(2012-METRIC)  [RESC2012X65]
R127  SR2012-N.C  R_CHIP-0805(2012-METRIC)  [RESC2012X65]
R128  SR2012-N.C  R_CHIP-0805(2012-METRIC)  [RESC2012X65]
R129  SR2012-N.C  R_CHIP-0805(2012-METRIC)  [RESC2012X65]
R130  SR2012-N.C  R_CHIP-0805(2012-METRIC)  [RESC2012X65]
RM10  CAY16-103J4LF  CN1J4TTD000J  [CN1J4TTD000J]
RM11  CAY16-103J4LF  CN1J4TTD000J  [CN1J4TTD000J]
RM12  CAY16-103J4LF  CN1J4TTD000J  [CN1J4TTD000J]
U13  74VHCV541FT  [74VHCV54XFT]

### Nets
+3.3VD: C61.2 C62.2 D12.2(C2) D13.2(C2) D14.2(C2) D15.2(C2) D16.2(C2) D17.2(C2) D18.2(C2) D19.2(C2) D20.2(C2) D21.2(C2) U5.20(-9:VCC) U13.20(-9:VCC) ; supply symbol labelled +V ; also sheet 1,2,4
+5VD: R95.2 R96.2 R97.2 R98.2 R99.2 R100.2 R101.2 R102.2 R103.2 R104.2 ; supply symbol labelled +V ; also sheet 1,2,4
BELTS: R111.1 ; also sheet 2,4
BREAK: R115.1 ; also sheet 2,4
CHARGE: R119.1 ; also sheet 2,4
CHECK_HEAT: R113.1 ; also sheet 2,4
DGND: C51.2 C52.2 C53.2 C54.2 C55.2 C56.2 C57.2 C58.2 C59.2 C60.2 C61.1 C62.1 D12.1(A1) D13.1(A1) D14.1(A1) D15.1(A1) D16.1(A1) D17.1(A1) D18.1(A1) D19.1(A1) D20.1(A1) D21.1(A1) Q1.5(GND2) Q1.7(GND1) Q2.5(GND2) Q2.7(GND1) Q3.5(GND2) Q3.7(GND1) Q4.5(GND2) Q4.7(GND1) Q5.5(GND1) Q5.6(GND2) Q5.7(GND3) Q5.8(GND4) Q6.5(GND1) Q6.6(GND2) Q6.7(GND3) Q6.8(GND4) Q7.5(GND1) Q7.6(GND2) Q7.7(GND3) Q7.8(GND4) Q8.5(GND1) Q8.6(GND2) Q8.7(GND3) Q8.8(GND4) R121.1 R122.1 R123.1 R124.1 R125.1 R126.1 R127.1 R128.1 R129.1 R130.1 RM10.P$1 RM10.P$2 RM10.P$3 RM10.P$4 RM11.P$1 RM11.P$2 RM11.P$3 RM11.P$4 RM12.P$1 RM12.P$2 RM12.P$3 RM12.P$4 U5.8(-7:A) U5.9(-8:A) U5.10(-9:GND) U5.19(-9:G2#) U13.10(-9:GND) U13.19(-9:G2#) ; also sheet 1,4
DI0: R95.1 R105.1 ; also sheet 4
DI1: R96.1 R106.1 ; also sheet 4
DI2: R97.1 R107.1 ; also sheet 4
DI3: R98.1 R108.1 ; also sheet 4
DI4: R99.1 R110.1 ; also sheet 4
DI5: R100.1 R112.1 ; also sheet 4
DI6: R101.1 R114.1 ; also sheet 4
DI7: R102.1 R116.1 ; also sheet 4
DI8: R103.1 R118.1 ; also sheet 4
DI9: R104.1 R120.1 ; also sheet 4
DII0: RM10.P$8 U6.24(-3:MTCLKA(SW_A)) U13.11(-8:Y)
DII1: RM10.P$7 U6.23(-3:MTCLKB(SW_B)) U13.12(-7:Y)
DII2: RM10.P$6 U6.86(-3:PD0) U13.13(-6:Y)
DII3: RM10.P$5 U6.85(-3:PD1) U13.14(-5:Y)
DII4: RM11.P$8 U6.84(-3:PD2) U13.15(-4:Y)
DII5: RM11.P$7 U6.83(-3:PD3) U13.16(-3:Y)
DII6: RM11.P$6 U6.82(-3:PD4) U13.17(-2:Y)
DII7: RM11.P$5 U6.81(-3:PD5) U13.18(-1:Y)
DII8: RM12.P$8 U5.15(-4:Y) U6.80(-3:PD6/MTIOC8A(SPEED))
DII9: RM12.P$7 U5.16(-3:Y) U6.79(-3:PD7)
DO0: Q1.3(IN2) U6.44(-3:P50)
DO1: Q1.1(IN1) U6.43(-3:P51)
DO1-0: Q1.6(OUT2) ; also sheet 4
DO1-1: Q1.8(OUT1) ; also sheet 4
DO1-2: Q2.6(OUT2) ; also sheet 4
DO1-3: Q2.8(OUT1) ; also sheet 4
DO1-4: Q3.6(OUT2) ; also sheet 4
DO1-5: Q3.8(OUT1) ; also sheet 4
DO1-6: Q4.6(OUT2) ; also sheet 4
DO1-7: Q4.8(OUT1) ; also sheet 4
DO2: Q2.3(IN2) U6.42(-3:P52)
DO2-0: Q5.9(OUT) Q5.P$1(OUT) Q5.P$2(OUT) ; also sheet 4
DO2-1: Q6.9(OUT) Q6.P$1(OUT) Q6.P$2(OUT) ; also sheet 4
DO2-2: Q7.9(OUT) Q7.P$1(OUT) Q7.P$2(OUT) ; also sheet 4
DO2-3: Q8.9(OUT) Q8.P$1(OUT) Q8.P$2(OUT) ; also sheet 4
DO3: Q2.1(IN1) U6.41(-3:P53)
DO4: Q3.3(IN2) U6.40(-3:P54)
DO5: Q3.1(IN1) U6.39(-3:P55)
DO6: Q4.3(IN2) U6.52(-3:PC0)
DO7: Q4.1(IN1) U6.51(-3:PC1)
DO8: Q5.1(IN) U6.50(-3:PC2)
DO9: Q6.1(IN) U6.49(-3:PC3)
DO10: Q7.1(IN) U6.48(-3:PC4)
DO11: Q8.1(IN) U6.47(-3:PC5)
LUMINANCE: R109.1 ; also sheet 2,4
N$54: C51.1 D12.3(C1A2) R105.2 R121.2 U13.9(-8:A)
N$55: C53.1 D14.3(C1A2) R107.2 R123.2 U13.7(-6:A)
N$56: C52.1 D13.3(C1A2) R106.2 R122.2 U13.8(-7:A)
N$60: C60.1 D21.3(C1A2) R119.2 R120.2 R130.2 U5.4(-3:A)
N$67: C54.1 D15.3(C1A2) R108.2 R124.2 U13.6(-5:A)
N$68: C55.1 D16.3(C1A2) R109.2 R110.2 R125.2 U13.5(-4:A)
N$69: C56.1 D17.3(C1A2) R111.2 R112.2 R126.2 U13.4(-3:A)
N$70: C57.1 D18.3(C1A2) R113.2 R114.2 R127.2 U13.3(-2:A)
N$71: C58.1 D19.3(C1A2) R115.2 R116.2 R128.2 U13.2(-1:A)
N$72: C59.1 D20.3(C1A2) R117.2 R118.2 R129.2 U5.5(-4:A)
OE: U5.1(-9:G1#) U13.1(-9:G1#) ; also sheet 1
SPEED: R117.1 ; also sheet 4
Unconnected: Q1.2(ST1) Q1.4(ST2) Q2.2(ST1) Q2.4(ST2) Q3.2(ST1) Q3.4(ST2) Q4.2(ST1) Q4.4(ST2) Q5.2(N.C.1) Q5.3(ST) Q5.4(N.C.2) Q6.2(N.C.1) Q6.3(ST) Q6.4(N.C.2) Q7.2(N.C.1) Q7.3(ST) Q7.4(N.C.2) Q8.2(N.C.1) Q8.3(ST) Q8.4(N.C.2) RM12.P$5 RM12.P$6 U5.11(-8:Y) U5.12(-7:Y)

### Notes on the sheet
- Lowside IPD  3A x 4ch
- オン抵抗80mΩ
  過電流制限値13A
  出力クランプ電圧40V
  アクティブクランプ耐量200mJ
- DIGITAL-OUT 8ch
- DIGITAL-IN 10ch
- Push Switch-IN | fc = 4.8kHz
- Lowside IPD  1A x 8ch
- fc = 4.8kHz
- Rotary Enc-B
- 過電流制限値4.3A
  出力クランプ電圧40V
  アクティブクランプ耐量500mJ
- fc = 4.8kHz
- Rotary Enc-A | Digital IN/OUT I/F

## Sheet 4 of 4
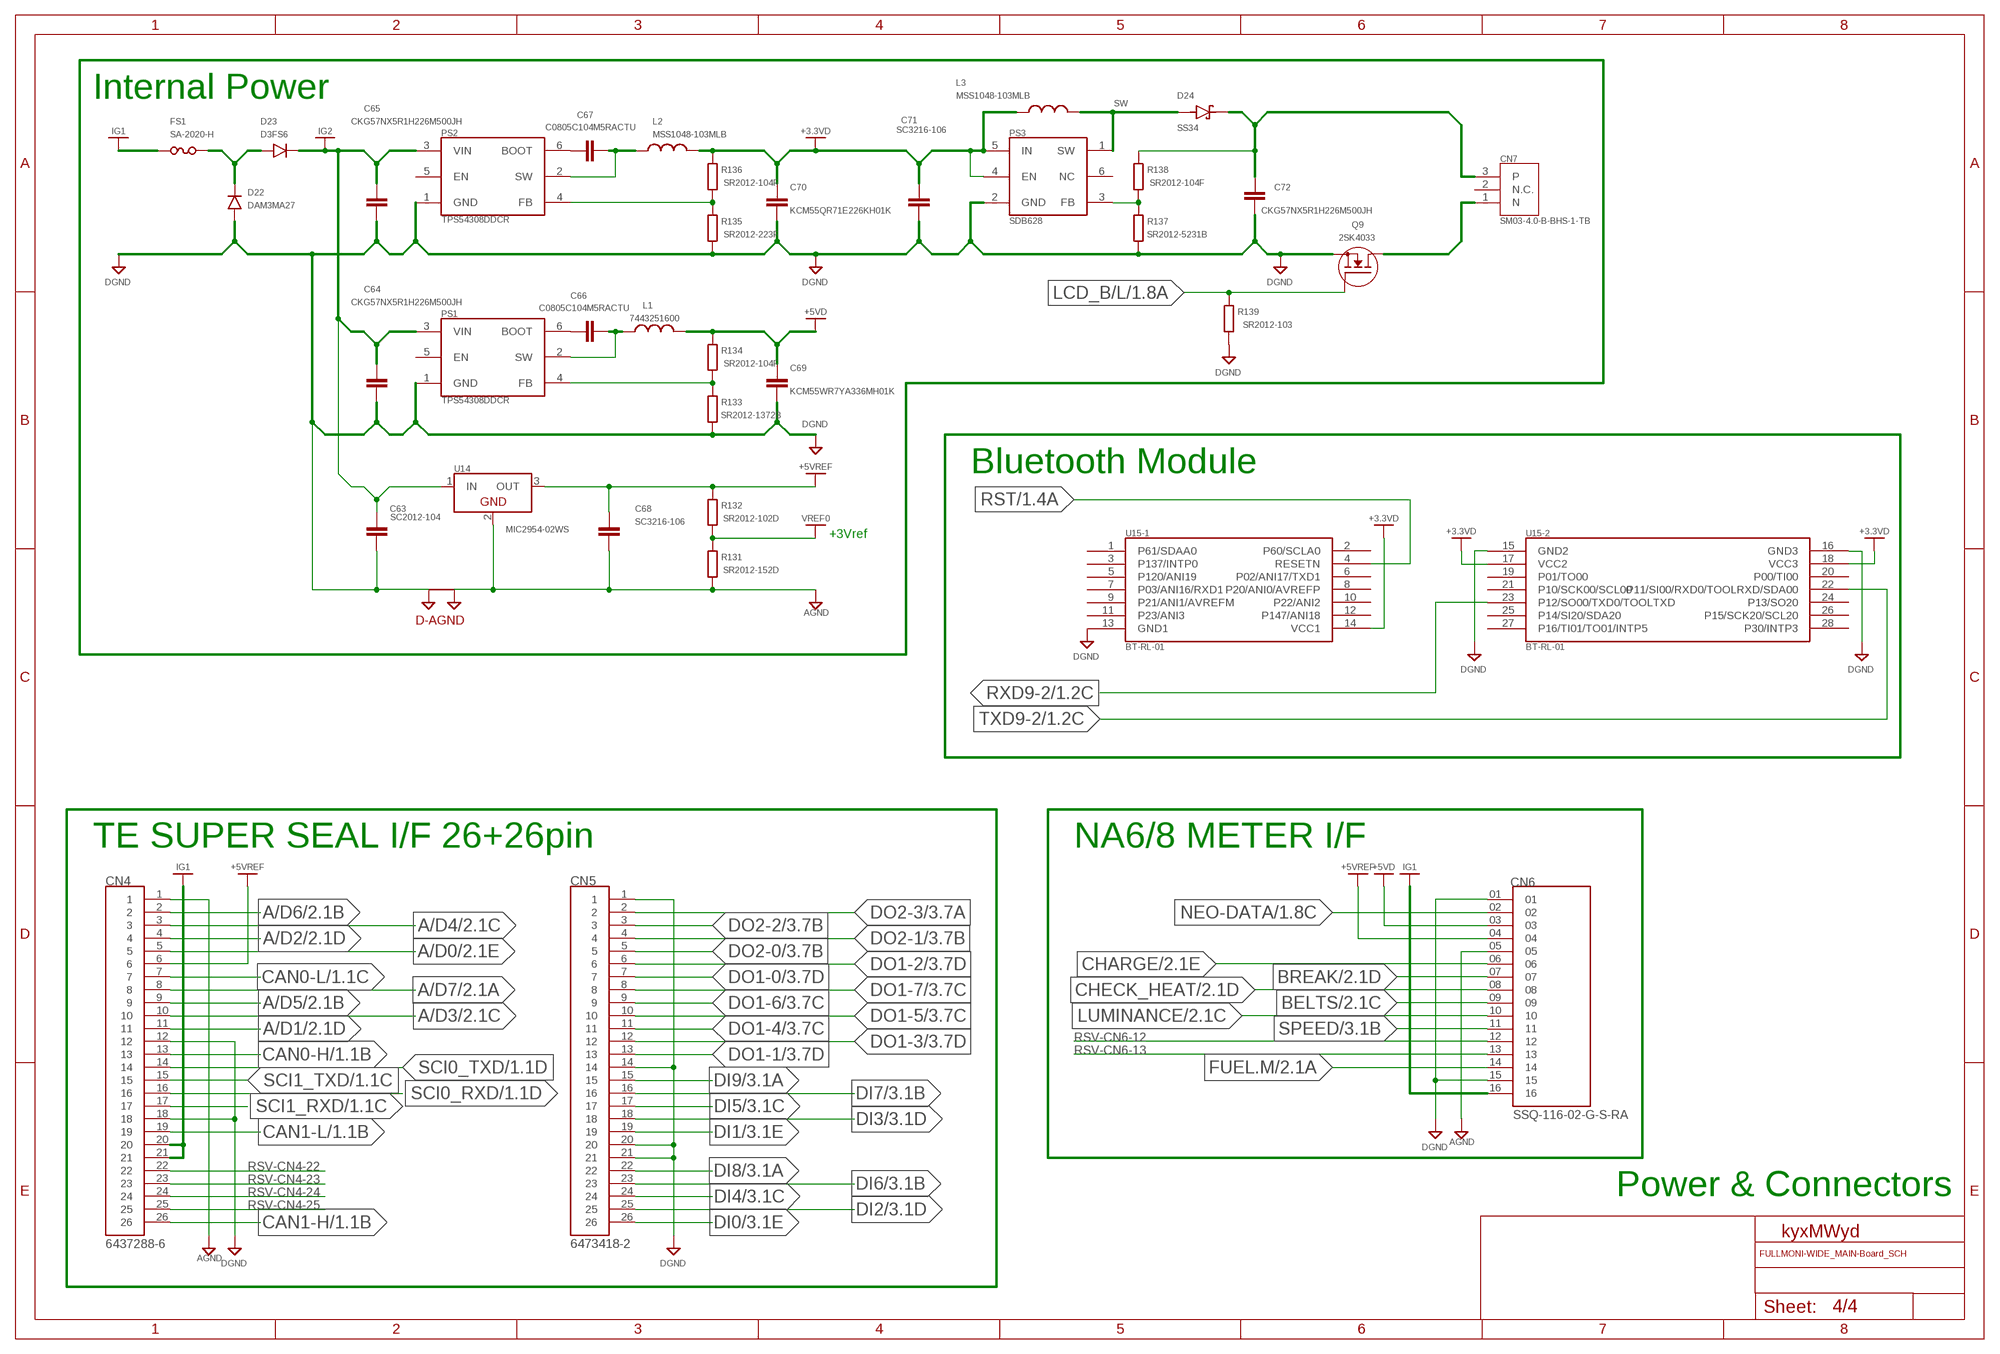
[diagram p4: schematic, sheet 4]

### Parts
$4_490_$_2024-03-09_15-35-59  D-AGND  [D-AGND]
C63  SC2012-104  C_CHIP-0805(2012-METRIC)  [CAPC2012X110]
C64  CKG57NX5R1H226M500JH  [CKG57NX5R1H226M500JH]
C65  CKG57NX5R1H226M500JH  [CKG57NX5R1H226M500JH]
C66  C0805C104M5RACTU  C_CHIP-0805(2012-METRIC)  [CAPC2012X110]
C67  C0805C104M5RACTU  C_CHIP-0805(2012-METRIC)  [CAPC2012X110]
C68  SC3216-106  C_CHIP-1206(3216-METRIC)  [CAPC3216X135]
C69  KCM55WR7YA336MH01K  KCM55QR71E226KH01K  [KCM55QR71E226KH01K]
C70  KCM55QR71E226KH01K  [KCM55QR71E226KH01K]
C71  SC3216-106  C_CHIP-1206(3216-METRIC)  [CAPC3216X135]
C72  CKG57NX5R1H226M500JH  [CKG57NX5R1H226M500JH]
CN4  6437288-6  [TE_6437288-6]
CN5  6473418-2  [TE_6473418-2]
CN6  SSQ-116-02-G-S-RA  [SAMTEC_SSQ-116-02-G-S-RA]
CN7  SM03-4.0-B-BHS-1-TB  [SM03-4.0-B-BHS-1-TB]
D22  DAM3MA27  [DAM3MA27]
D23  D3FS6  [D3FS6]
D24  SS34  [DIOM6859X262N]
FS1  SA-2020-H  [SA-2020-H]
L1  7443251600  [MSS1048-103MLB]
L2  MSS1048-103MLB  [MSS1048-103MLB]
L3  MSS1048-103MLB  [MSS1048-103MLB]
PS1  TPS54308DDCR  TPS54308DDCSOT23-6  [DBV_R-PDSO-G6]
PS2  TPS54308DDCR  TPS54308DDCSOT23-6  [DBV_R-PDSO-G6]
PS3  SDB628  SDB628SDB628  [TSOT23-6_DDC]
Q9  2SK4033  RJF0604JPD  [RJF0604JPD]
R131  SR2012-152D  R_CHIP-0805(2012-METRIC)  [RESC2012X65]
R132  SR2012-102D  R_CHIP-0805(2012-METRIC)  [RESC2012X65]
R133  SR2012-1372B  R_CHIP-0805(2012-METRIC)  [RESC2012X65]
R134  SR2012-104F  R_CHIP-0805(2012-METRIC)  [RESC2012X65]
R135  SR2012-223F  R_CHIP-0805(2012-METRIC)  [RESC2012X65]
R136  SR2012-104F  R_CHIP-0805(2012-METRIC)  [RESC2012X65]
R137  SR2012-5231B  R_CHIP-0805(2012-METRIC)  [RESC2012X65]
R138  SR2012-104F  R_CHIP-0805(2012-METRIC)  [RESC2012X65]
R139  SR2012-103  R_CHIP-0805(2012-METRIC)  [RESC2012X65]
U14  MIC2954-02WS  [MIC2954-02WS]
U15  BT-RL-01  [BT-RL-01]

### Nets
+3.3VD: C70.P$1 C71.1 L2.P$2 L3.P$1 PS3.4(EN) PS3.5(IN) R136.2 U15.14(-1:VCC1) U15.17(-2:VCC2) U15.18(-2:VCC3) ; supply symbol labelled +V ; also sheet 1,2,3
+5VD: C69.P$1 CN6.03 L1.P$2 R134.2 ; supply symbol labelled +V ; also sheet 1,2,3
+5VREF: C68.1 CN4.6 CN6.04 R132.2 U14.3(OUT) ; supply symbol labelled +V ; also sheet 2
A/D0: CN4.5 ; also sheet 2
A/D1: CN4.11 ; also sheet 2
A/D2: CN4.4 ; also sheet 2
A/D3: CN4.10 ; also sheet 2
A/D4: CN4.3 ; also sheet 2
A/D5: CN4.9 ; also sheet 2
A/D6: CN4.2 ; also sheet 2
A/D7: CN4.8 ; also sheet 2
AGND: $4_490_$_2024-03-09_15-35-59.2(AGND) C68.2 CN4.1 CN6.05 R131.1 U14.2(GND) ; also sheet 2
BELTS: CN6.09 ; also sheet 2,3
BREAK: CN6.07 ; also sheet 2,3
CAN0-H: CN4.13 ; also sheet 1
CAN0-L: CN4.7 ; also sheet 1
CAN1-H: CN4.26 ; also sheet 1
CAN1-L: CN4.19 ; also sheet 1
CHARGE: CN6.06 ; also sheet 2,3
CHECK_HEAT: CN6.08 ; also sheet 2,3
DGND: $4_490_$_2024-03-09_15-35-59.1(DGND) C63.2 C64.P$2 C65.P$2 C69.P$2 C70.P$2 C71.2 C72.P$1 CN4.12 CN4.18 CN5.1 CN5.14 CN5.20 CN5.21 CN6.01 CN6.15 D22.P$1 PS1.1(GND) PS2.1(GND) PS3.2(GND) Q9.3(S) R133.1 R135.1 R137.1 R139.1 U15.13(-1:GND1) U15.15(-2:GND2) U15.16(-2:GND3) ; also sheet 1,3
DI0: CN5.26 ; also sheet 3
DI1: CN5.19 ; also sheet 3
DI2: CN5.25 ; also sheet 3
DI3: CN5.18 ; also sheet 3
DI4: CN5.24 ; also sheet 3
DI5: CN5.17 ; also sheet 3
DI6: CN5.23 ; also sheet 3
DI7: CN5.16 ; also sheet 3
DI8: CN5.22 ; also sheet 3
DI9: CN5.15 ; also sheet 3
DO1-0: CN5.7 ; also sheet 3
DO1-1: CN5.13 ; also sheet 3
DO1-2: CN5.6 ; also sheet 3
DO1-3: CN5.12 ; also sheet 3
DO1-4: CN5.11 ; also sheet 3
DO1-5: CN5.10 ; also sheet 3
DO1-6: CN5.9 ; also sheet 3
DO1-7: CN5.8 ; also sheet 3
DO2-0: CN5.5 ; also sheet 3
DO2-1: CN5.4 ; also sheet 3
DO2-2: CN5.3 ; also sheet 3
DO2-3: CN5.2 ; also sheet 3
FUEL.M: CN6.14 ; also sheet 2
IG1: CN4.20 CN4.21 CN6.16 FS1.2 ; supply symbol labelled +V ; also sheet 2
IG2: C63.1 C64.P$1 C65.P$1 D23.P$2 PS1.3(VIN) PS2.3(VIN) U14.1(IN) ; supply symbol labelled +V
LCD-A: C72.P$2 CN7.3(P) D24.C(K) R138.2
LCD-K: CN7.1(N) Q9.4(D)
LCD_B/L: Q9.1(G) R139.2 ; also sheet 1
LUMINANCE: CN6.10 ; also sheet 2,3
N$4: D22.P$2 D23.P$1 FS1.1
N$6: C67.2 PS2.6(BOOT)
N$7: C66.2 PS1.6(BOOT)
N$19: C67.1 L2.P$1 PS2.2(SW)
N$20: C66.1 L1.P$1 PS1.2(SW)
N$21: PS2.4(FB) R135.2 R136.1
N$23: PS1.4(FB) R133.2 R134.1
N$26: PS3.3(FB) R137.2 R138.1
NEO-DATA: CN6.02 ; also sheet 1
RST: U15.4(-1:RESETN) ; also sheet 1
RSV-CN4-22: CN4.22
RSV-CN4-23: CN4.23
RSV-CN4-24: CN4.24
RSV-CN4-25: CN4.25
RSV-CN6-12: CN6.12
RSV-CN6-13: CN6.13
RXD9-2: U15.23(-2:P12/SO00/TXD0/TOOLTXD) ; also sheet 1
SCI0_RXD: CN4.16 ; also sheet 1
SCI0_TXD: CN4.14 ; also sheet 1
SCI1_RXD: CN4.17 ; also sheet 1
SCI1_TXD: CN4.15 ; also sheet 1
SPEED: CN6.11 ; also sheet 3
SW: D24.A L3.P$2 PS3.1(SW)
TXD9-2: U15.22(-2:P11/SI00/RXD0/TOOLRXD/SDA00) ; also sheet 1
VREF0: R131.2 R132.1 ; supply symbol labelled +V ; also sheet 2
Unconnected: CN7.2(N.C.) PS1.5(EN) PS2.5(EN) PS3.6(NC) U15.1(-1:P61/SDAA0) U15.2(-1:P60/SCLA0) U15.3(-1:P137/INTP0) U15.5(-1:P120/ANI19) U15.6(-1:P02/ANI17/TXD1) U15.7(-1:P03/ANI16/RXD1) U15.8(-1:P20/ANI0/AVREFP) U15.9(-1:P21/ANI1/AVREFM) U15.10(-1:P22/ANI2) U15.11(-1:P23/ANI3) U15.12(-1:P147/ANI18) U15.19(-2:P01/TO00) U15.20(-2:P00/TI00) U15.21(-2:P10/SCK00/SCL00) U15.24(-2:P13/SO20) U15.25(-2:P14/SI20/SDA20) U15.26(-2:P15/SCK20/SCL20) U15.27(-2:P16/TI01/TO01/INTP5) U15.28(-2:P30/INTP3)

### Notes on the sheet
- Internal Power
- Bluetooth Module
- +3Vref
- TE SUPER SEAL I/F 26+26pin | NA6/8 METER I/F
- Power & Connectors

## Library data of the parts
$4_490_$_2024-03-09_15-35-59 = ECADライブラリ:D-AGND
BT1 = ECADライブラリ:120591-1
C1-C14 C16-C63 C66-C68 C71 = Capacitor:C: Capacitor - Generic; CATEGORY: Capacitor
C64 C65 C72 = ECADライブラリ:CKG57NX5R1H226M500JH
C69 C70 = ECADライブラリ:KCM55QR71E226KH01K
CN1 = ECADライブラリ:500075-1517
CN2 = ECADライブラリ:105057-0001
CN3 = ECADライブラリ:FH12A-40S-0.5SH
CN4 = ECADライブラリ:6437288-6: CONN RECPT 26POS T/H 3MM SN; MANUFACTURER: TE Connectivity; PARTREV: A2; STANDARD: Manufacturer recommended
CN5 = ECADライブラリ:6473418-2: Conn Shrouded Header PIN 26 POS 1.5mm Solder ST Thru-Hole Automotive Tube; MANUFACTURER: TE CONNECTIVITY; PARTREV: A2; STANDARD: MANUFACTURER RECOMMENDATION
CN6 = ECADライブラリ:SSQ-116-02-G-S-RA; MANUFACTURER: Samtec; PARTREV: R; STANDARD: Manufacturer Recommendations
CN7 = ECADライブラリ:SM03-4.0-B-BHS-1-TB
CN8 = Connectors:S2B-XH-A(LF)(SN): CONN HEADER R/A 2POS 2.5MM Manufacturer's datasheet <http://www.jst-mfg.com/product/pdf/eng/eXH.pdf>; CREATED_BY: PCBLayout.com; DIGIKEY_PART_NUMBER: 455-2257-ND; MANUFACTURER: JST Sales America Inc.; MPN: S2B-XH-A(LF)(SN)
D1 D2 D4-D21 D25 = diode:BAT54S: Schottky Diodes Pin connection corrected 2011-05-04 Source: Fairchild .. BAT54.pdf
D3 = ECADライブラリ:1SS321
D22 = ECADライブラリ:DAM3MA27
D23 = ECADライブラリ:D3FS6
D24 = ECADライブラリ:SS34; MANUFACTURER: Taiwan Semiconductor; MAXIMUM_PACKAGE_HEIGHT: 2.62 mm; PARTREV: Q2102; STANDARD: IPC-7351B
FB1-FB4 = ECADライブラリ:FB_: Ferrite Bead - Popular parts; CATEGORY: Filter; DESCRIPTION: FERRITE BEAD 330 OHM 0805 1LN; MANUFACTURER: Murata Electronics; SUB-CATEGORY: Ferrite bead
FS1 = ECADライブラリ:SA-2020-H
J1 = ECADライブラリ:SAMTEC-TST-107-01-X-D
JP1 JP2 = ECADライブラリ:PINHD-1X2: PIN HEADER
JP3 = ECADライブラリ:PINHD-2X20: PIN HEADER
L1 = ECADライブラリ:7443251600
L2 L3 = ECADライブラリ:MSS1048-103MLB
NF1 NF2 = ECADライブラリ:ACT45B-510-2P
PS1 PS2 = ECADライブラリ:TPS54308DDC
PS3 = ECADライブラリ:SDB628
Q1-Q4 = ECADライブラリ:BM2LE250FJ-C
Q5-Q8 = ECADライブラリ:BV1LE080EFJ-C
Q9 = ECADライブラリ:RJF0604JPD
R1-R43 R45-R58 R60-R140 = Resistor:R: Resistor Fixed - Generic; CATEGORY: Resistor; SUB-CATEGORY: Fixed
R44 R59 = ECADライブラリ:RLF3SJ
RM1-RM12 = ECADライブラリ:CN1J4TTD000J
SW1 SW2 = ECADライブラリ:CJS-1200B
U1 = ECADライブラリ:ISL61861BIBZ
U2 = ECADライブラリ:BD5230G-1
U3 U4 = ECADライブラリ:SN65HVD230D
U5 U13 = ECADライブラリ:74VHCV541FT
U6 = ECADライブラリ:R5F572NNXXFP
U7 = ECADライブラリ:ATTINY85-20SUR; COPYRIGHT: Copyright (C) 2024 Ultra Librarian. All rights reserved.; MANUFACTURER_PART_NUMBER: ATTINY85-20SUR; MFR_NAME: Microchip
U9 = ECADライブラリ:BR24A16F-WLB
U10 U11 = ECADライブラリ:MCP6024-I/ST
U12 = ECADライブラリ:LM4861M
U14 = ECADライブラリ:MIC2954-02WS
U15 = ECADライブラリ:BT-RL-01
X1 = ECADライブラリ:CSTNE24M0VH3C000
X2 = ECADライブラリ:FC-135